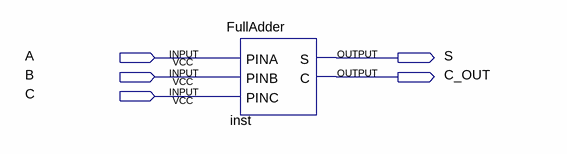
[diagram p0: schematic sheet]
// Quartus schematic test.bdf as structural Verilog: 1 symbols, 5 pins
module test (
  input  A,
  input  B,
  input  C,
  output S,
  output C_OUT
);

  FullAdder inst (.PINA(A), .PINB(B), .PINC(C), .S(S), .C(C_OUT));
endmodule
